# Altium schematic sheet MCU.SchDoc: MCU
size B
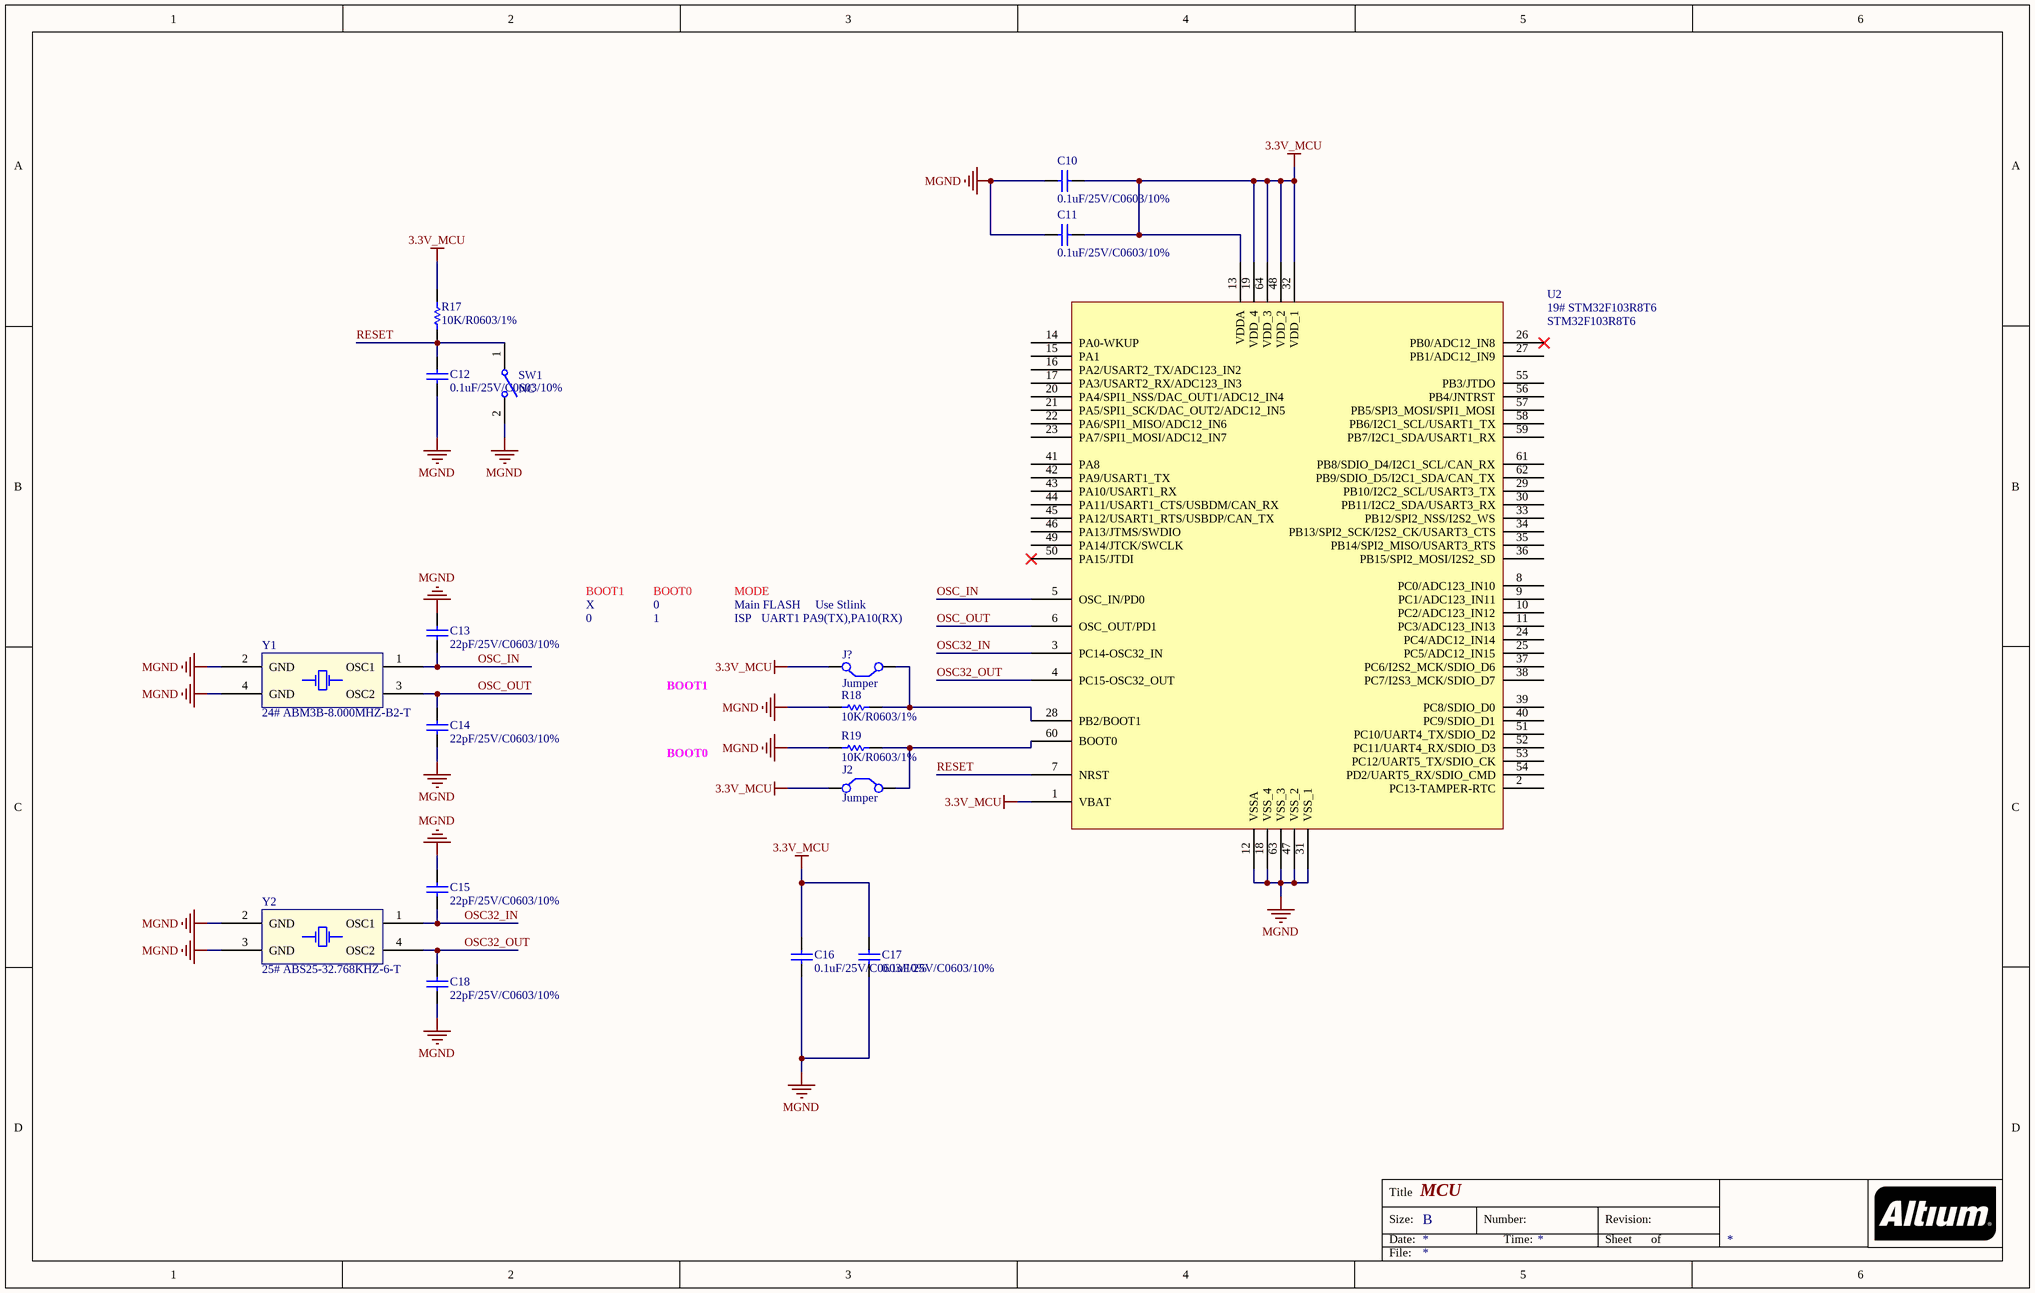
[diagram p0: MCU.SchDoc]

## Parts
C10  0.1uF/25V/C0603/10%  [Cap Ceramic 0603 SMD]
C11  0.1uF/25V/C0603/10%  [Cap Ceramic 0603 SMD]
C12  0.1uF/25V/C0603/10%  [Cap Ceramic 0603 SMD]
C13  22pF/25V/C0603/10%  [Cap Ceramic 0603 SMD]
C14  22pF/25V/C0603/10%  [Cap Ceramic 0603 SMD]
C15  22pF/25V/C0603/10%  [Cap Ceramic 0603 SMD]
C16  0.1uF/25V/C0603/10%  [Cap Ceramic 0603 SMD]
C17  0.1uF/25V/C0603/10%  [Cap Ceramic 0603 SMD]
C18  22pF/25V/C0603/10%  [Cap Ceramic 0603 SMD]
J2  Jumper  [Header_2]
J?  Jumper  [Header_2]
R17  10K/R0603/1%  [Res 0603 SMD]
R18  10K/R0603/1%  [Res 0603 SMD]
R19  10K/R0603/1%  [Res 0603 SMD]
SW1  NC  [SW603625-R2]
U2  19# STM32F103R8T6  Supplier Part Number 1: STM32F103R8T6  [19# STMF103R8T6]
Y1  24# ABM3B-8.000MHZ-B2-T  [24# ABM3B-8.000MHZ]
Y2  25# ABS25-32.768KHZ-6-T  [25# ABS25]

## Nets
3.3V_MCU: C10.2 C11.2 C16.2 C17.2 J2.1(C1) J?.1(C1) R17.2 U2.1(VBAT) U2.13(VDDA) U2.19(VDD_4) U2.32(VDD_1) U2.48(VDD_2) U2.64(VDD_3)
MGND: C10.1 C11.1 C12.1 C13.1 C14.2 C15.2 C16.1 C17.1 C18.1 R18.2 R19.1 SW1.2(NO1) U2.12(VSSA) U2.18(VSS_4) U2.31(VSS_1) U2.47(VSS_2) U2.63(VSS_3) Y1.2(GND) Y1.4(GND) Y2.2(GND) Y2.3(GND)
OSC32_IN: C15.1 U2.3(PC14-OSC32_IN) Y2.1(OSC1)
OSC32_OUT: C18.2 U2.4(PC15-OSC32_OUT) Y2.4(OSC2)
OSC_IN: C13.2 U2.5(OSC_IN/PD0) Y1.1(OSC1)
OSC_OUT: C14.1 U2.6(OSC_OUT/PD1) Y1.3(OSC2)
RESET: C12.2 R17.1 SW1.1(COMMON1) U2.7(NRST)
NetJ2_2: J2.2(C2) R19.2 U2.60(BOOT0)
NetJ?_2: J?.2(C2) R18.1 U2.28(PB2/BOOT1)

Not connected (* = marked no-connect by the designer): U2 2(PC13-TAMPER-RTC) 8(PC0/ADC123_IN10) 9(PC1/ADC123_IN11) 10(PC2/ADC123_IN12) 11(PC3/ADC123_IN13) 14(PA0-WKUP) 15(PA1) 16(PA2/USART2_TX/ADC123_IN2) 17(PA3/USART2_RX/ADC123_IN3) 20(PA4/SPI1_NSS/DAC_OUT1/ADC12_IN4) 21(PA5/SPI1_SCK/DAC_OUT2/ADC12_IN5) 22(PA6/SPI1_MISO/ADC12_IN6) 23(PA7/SPI1_MOSI/ADC12_IN7) 24(PC4/ADC12_IN14) 25(PC5/ADC12_IN15) 26(PB0/ADC12_IN8)* 27(PB1/ADC12_IN9) 29(PB10/I2C2_SCL/USART3_TX) 30(PB11/I2C2_SDA/USART3_RX) 33(PB12/SPI2_NSS/I2S2_WS) 34(PB13/SPI2_SCK/I2S2_CK/USART3_CTS) 35(PB14/SPI2_MISO/USART3_RTS) 36(PB15/SPI2_MOSI/I2S2_SD) 37(PC6/I2S2_MCK/SDIO_D6) 38(PC7/I2S3_MCK/SDIO_D7) 39(PC8/SDIO_D0) 40(PC9/SDIO_D1) 41(PA8) 42(PA9/USART1_TX) 43(PA10/USART1_RX) 44(PA11/USART1_CTS/USBDM/CAN_RX) 45(PA12/USART1_RTS/USBDP/CAN_TX) 46(PA13/JTMS/SWDIO) 49(PA14/JTCK/SWCLK) 50(PA15/JTDI)* 51(PC10/UART4_TX/SDIO_D2) 52(PC11/UART4_RX/SDIO_D3) 53(PC12/UART5_TX/SDIO_CK) 54(PD2/UART5_RX/SDIO_CMD) 55(PB3/JTDO) 56(PB4/JNTRST) 57(PB5/SPI3_MOSI/SPI1_MOSI) 58(PB6/I2C1_SCL/USART1_TX) 59(PB7/I2C1_SDA/USART1_RX) 61(PB8/SDIO_D4/I2C1_SCL/CAN_RX) 62(PB9/SDIO_D5/I2C1_SDA/CAN_TX)

## Notes on the sheet
- BOOT1
- X
- 0
- BOOT0
- 1
- MODE
- Main FLASH
- ISP
- (near J?) UART1 PA9(TX),PA10(RX)
- Use Stlink
- Title
- Size:
- Date:
- B
- Number:
- Time:
- Revision:
- Sheet
- of
- File:

## Library data of the parts
C10-C12 C16 C17 = 0.1uF/25V/C0603/10%: CAP CER 0.1UF 25V 10% X7R 0603; Manufacturer: Murata Electronics North America; Manufacturer Part Number: GRM188R71E104KA01D; Capacitance: 0.1µF; RoHS: RoHS Compliant; Category: Capacitors; Packaging: Cut Tape (CT); Tolerance: ±10%; Voltage - Rated: 25V; Temperature Coefficient: X7R; Mounting Type: Surface Mount, MLCC; Operating Temperature: -55°C ~ 125°C; Applications: General Purpose; Ratings: -; Package / Case: 0603 (1608 Metric); Size / Dimension: 0.063" L x 0.031" W (1.60mm x 0.80mm); Height - Seated (Max): -; Thickness (Max): 0.035" (0.90mm); Lead Spacing: -; Features: -; Lead Style: -; ComponentLink1URL: http://www.murata.com/~/media/webrenewal/support/library/catalog/products/capacitor/mlcc/c02e.ashx; ComponentLink1Description: http://www.murata.com/~/media/webrenewal/support/library/catalog/products/capacitor/mlcc/c02e.ashx; Supplier 1: Digi-Key; Supplier Part Number 1: 490-1524-1-ND
C13-C15 C18 = 22pF/50V/C0603/10%: CAP CER 22PF 50V NP0 0603; Manufacturer: Kemet; Manufacturer Part Number: C0603C220K5GACTU; Tolerance: ±10%; Temperature Coefficient: C0G, NP0; RoHS: RoHS Compliant; Category: Capacitors; Packaging: Digi-Reel®; Capacitance: 22pF; Voltage - Rated: 50V; Mounting Type: Surface Mount, MLCC; Operating Temperature: -55°C ~ 125°C; Applications: General Purpose; Ratings: -; Package / Case: 0603 (1608 Metric); Size / Dimension: 0.063" L x 0.031" W (1.60mm x 0.80mm); Height - Seated (Max): -; Thickness (Max): 0.034" (0.87mm); Lead Spacing: -; Features: -; Lead Style: -; ComponentLink1URL: http://www.kemet.com/docfinder?Partnumber=C0603C220K5GACTU; ComponentLink1Description: http://www.kemet.com/docfinder?Partnumber=C0603C220K5GACTU; Supplier 1: Digi-Key; Supplier Part Number 1: 399-7875-1-ND
J2 J? = Jumper: Jumper Wire; Published: 24-Mar-1999; LatestRevisionDate: 17-Jul-2002; LatestRevisionNote: Re-released for DXP Platform.; PackageReference: RAD-0.2; Publisher: Altium Limited; PackageDescription: Radial Cap, Thru-Hole; 2 Leads; 0.2 in Pin Spacing
R17-R19 = 10K/R0603/1%: RES SMD 10K OHM 1% 1/10W 0603; Manufacturer: Yageo; Manufacturer Part Number: RC0603FR-0710KL; Power (Watts): 0.1W, 1/10W; Temperature Coefficient: ±100ppm/°C; Supplier 1: Digi-Key; RoHS: RoHS Compliant; Category: Resistors; Stock 1: 11440000; Pricing 1: 5000=0.00167, 10000=0.00145, 25000=0.00128, 50000=0.00117, 125000=0.00115 (USD); Packaging: Tape & Reel (TR); Resistance (Ohms): 10k; Tolerance: ±1%; Composition: Thick Film; Features: Moisture Resistant; Operating Temperature: -55°C ~ 155°C; Package / Case: 0603 (1608 Metric); Supplier Device Package: 0603; Size / Dimension: 0.063" L x 0.031" W (1.60mm x 0.80mm); Height: 0.022" (0.55mm); Number of Terminations: 2; ComponentLink1URL: http://www.yageo.com/NewPortal/yageodocoutput?fileName=/pdf/R-Chip/PYu-RC_Group_51_RoHS_L_3.pdf; ComponentLink1Description: http://www.yageo.com/NewPortal/yageodocoutput?fileName=/pdf/R-Chip/PYu-RC_Group_51_RoHS_L_3.pdf; Supplier Part Number 1: 311-10.0KHRTR-ND
SW1 = BUTTON 2-SMD RS-282G05A3: SWITCH TACTILE SPST-NO 0.05A 12V; Manufacturer: C&K Components; Manufacturer Part Number: RS-282G05A3-SM RT; Switch Function: Off-Mom; Contact Rating @ Voltage: 0.05A @ 12VDC; Actuator Type: Rectangular Button; Actuator Height off PCB, from Pins: 2.50mm; Actuator Orientation: Top Actuated; Outline: 6.00mm x 3.60mm; Illumination: Non-Illuminated; Operating Force: 250gf; Actuator Material: Polyamide (PA), Nylon; Switch Travel: 0.25mm; Mechanical Life: 50,000 Cycles; RoHS: RoHS Compliant; Category: Switches; Packaging: Cut Tape (CT); Part Status: Active; Circuit: SPST-NO; Mounting Type: Surface Mount; Termination Style: Gull Wing; Illumination Voltage (Nominal): -; Illumination Type, Color: -; Ingress Protection: -; Features: -; Operating Temperature: -; ComponentLink1URL: http://media.digikey.com/pdf/Data%20Sheets/C&K/RS-282G05A-SM_RT.pdf; ComponentLink1Description: http://media.digikey.com/pdf/Data%20Sheets/C&K/RS-282G05A-SM_RT.pdf; Supplier 1: Digi-Key; Supplier Part Number 1: CKN10384CT-ND
U2 = 19# STM32F103R8T6: STM32 ARM-based 32-bit MCU with ARM 32-bit Cortex-M3 Microcontroller, 64 Kbytes Flash, 64-pin LQFP, Industrial Temperature; UART: 5; I2C: 2; SPI/I2S: 3; USB 2.0: 1; ARM Core: Cortex M3; Published: 30-May-2008; DatasheetVersion: rev6, Mar-2008; PackageVersion: Mar-2008; PackageReference: LQFP64; Publisher: Altium Limited; PackageDescription: 64-Pin Low-Profile Quad Flat Pack, 10 x 10 mm Body, 0.5 mm Pitch (LQFP64); ComponentLink1Description: Manufacturer Link; ComponentLink1URL: www.st.com/stm32; ComponentLink2Description: Datasheet; ComponentLink2URL: http://www.st.com/stonline/products/literature/ds/13587.pdf; CAN 2.0: 1; ADC: 3; DAC: 2; Case/Package: LQFP - 64; Supplier 1: Future Electronics
Y1 = 24# ABM3B-8.000MHZ-B2-T: CRYSTAL 8.0000MHZ 18PF SMD; Manufacturer: Abracon LLC; Frequency: 8MHz; Frequency Stability: ±50ppm; Frequency Tolerance: ±20ppm; ESR (Equivalent Series Resistance): 200 Ohm; Operating Mode: Fundamental; Manufacturer Part Number: ABM3B-8.000MHZ-B2-T; RoHS: RoHS Compliant; Category: Crystals and Oscillators; Packaging: Tape & Reel (TR); Type: MHz Crystal; Load Capacitance: 18pF; Operating Temperature: -20°C ~ 70°C; Ratings: -; Mounting Type: Surface Mount; Case/Package: ABM3B SMD 4 lead; Size / Dimension: 0.197" L x 0.126" W (5.00mm x 3.20mm); Height: 0.043" (1.10mm); ComponentLink1URL: http://www.abracon.com/Resonators/abm3b.pdf; ComponentLink1Description: http://www.abracon.com/Resonators/abm3b.pdf; Supplier 1: Digi-Key; Supplier Part Number 1: 535-9720-1-ND
Y2 = 25# ABS25-32.768KHZ-6-T: CRYSTAL 32.7680KHZ 6PF SMD; Manufacturer: Abracon LLC; Frequency Tolerance: ±20ppm; ESR (Equivalent Series Resistance): 50 kOhm; Operating Mode: Fundamental; Manufacturer Part Number: ABS25-32.768KHZ-6-T; RoHS: RoHS Compliant; Category: Crystals and Oscillators; Packaging: Digi-Reel®; Type: kHz Crystal (Tuning Fork); Frequency: 32.768kHz; Frequency Stability: -; Load Capacitance: 6pF; Operating Temperature: -40°C ~ 85°C; Ratings: -; Mounting Type: Surface Mount; Case/Package: ABS25 SMD 4 lead; Size / Dimension: 0.315" L x 0.150" W (8.00mm x 3.80mm); Height: 0.098" (2.50mm); ComponentLink1URL: http://www.abracon.com/Resonators/abs25.pdf; ComponentLink1Description: http://www.abracon.com/Resonators/abs25.pdf; Supplier 1: Digi-Key; Supplier Part Number 1: 535-10240-1-ND